# Altium schematic sheet Power.SchDoc
size A4
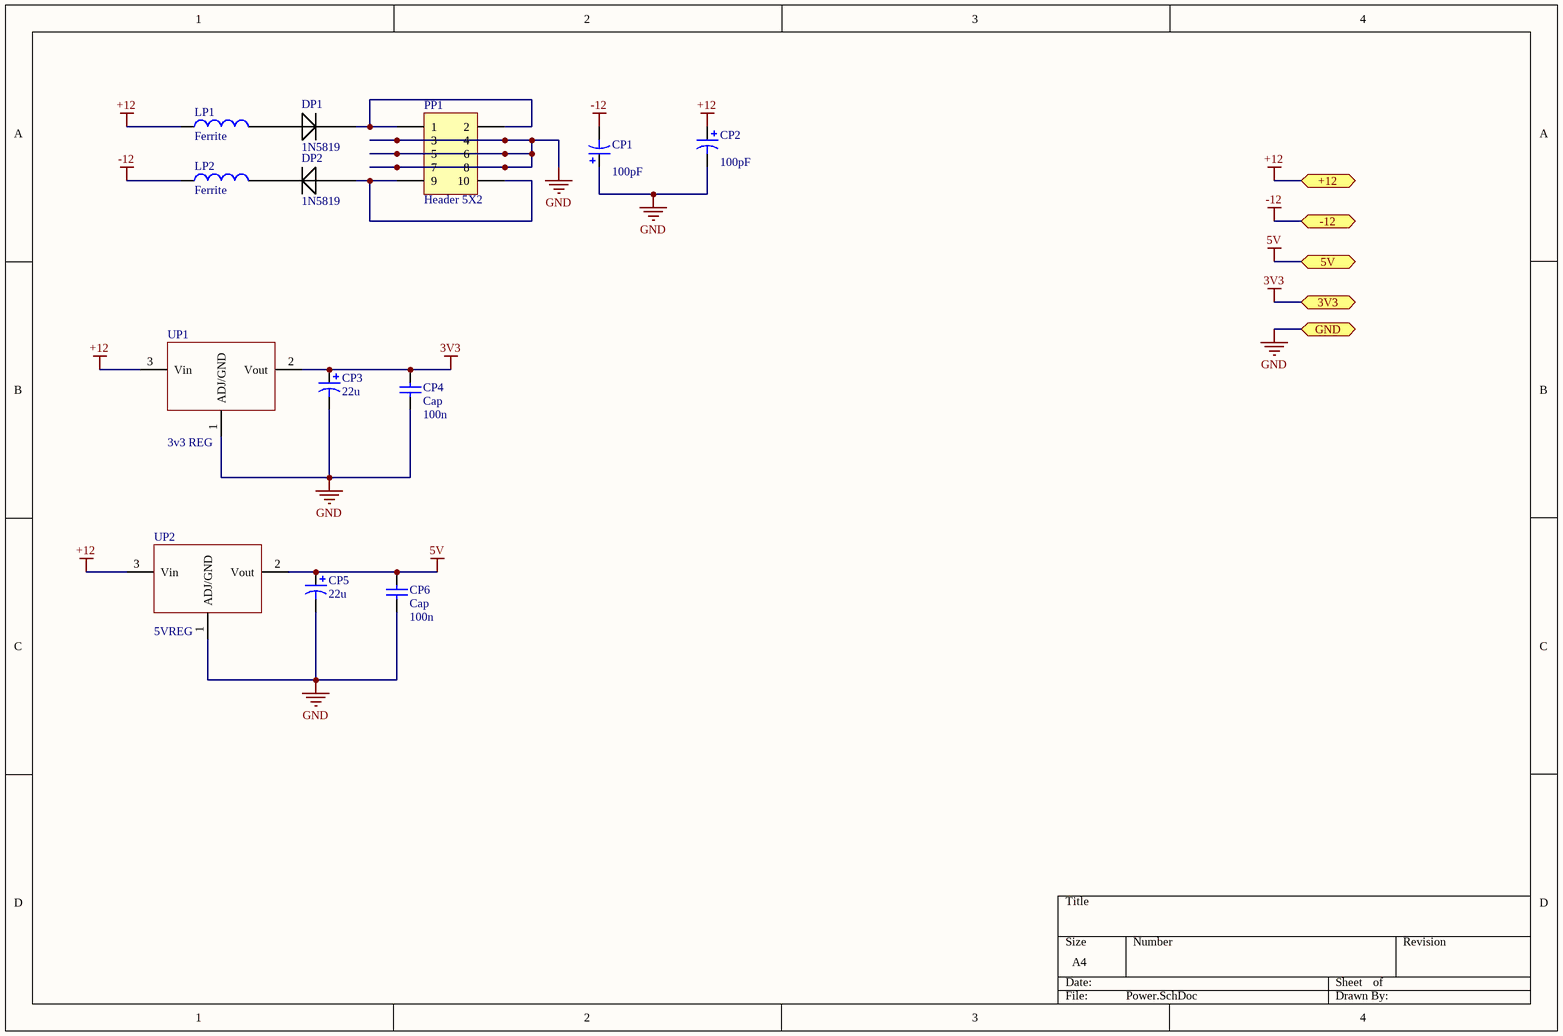
[diagram p0: Power.SchDoc]

## Parts
CP1  value 100pF  [C-RAD-4.5]  (hidden comment: Cap Pol2)
CP2  value 100pF  [C-RAD-4.5]  (hidden comment: Cap Pol2)
CP3  value 22u  [C 0603 / 1608]  (hidden comment: Cap Pol2)
CP4  Cap  value 100n  [C 0603 / 1608]
CP5  value 22u  [C 0603 / 1608]  (hidden comment: Cap Pol2)
CP6  Cap  value 100n  [C 0603 / 1608]
DP1  1N5819  [DO-41]
DP2  1N5819  [DO-41]
LP1  Ferrite  [RES0805R]
LP2  Ferrite  [RES0805R]
PP1  Header 5X2  [HDR2X5]
UP1  3v3 REG  [SOT-223-3 - REG]
UP2  5VREG  [SOT-223-3 - REG]

## Ports
3V3 (bidir), 5V (bidir), +12 (bidir), -12 (bidir), GND (bidir)

## Nets
3V3: CP3.1 CP4.2 UP1.2(Vout) ; port 3V3
5V: CP5.1 CP6.2 UP2.2(Vout) ; port 5V
+12: CP2.1 LP1.1 UP1.3(Vin) UP2.3(Vin) ; port +12
-12: CP1.2 LP2.1 ; port -12
GND: CP1.1 CP2.2 CP3.2 CP4.1 CP5.2 CP6.1 PP1.3 PP1.4 PP1.5 PP1.6 PP1.7 PP1.8 UP1.1(ADJ/GND) UP2.1(ADJ/GND) ; port GND
NetDP1_1: DP1.1 PP1.1 PP1.2
NetDP1_2: DP1.2 LP1.2
NetDP2_1: DP2.1 LP2.2
NetDP2_2: DP2.2 PP1.9 PP1.10

## Library data of the parts
CP1-CP3 CP5 = Cap Pol2: Polarized Capacitor (Axial); Published: 8-Jun-2000; LatestRevisionDate: 17-Jul-2002; LatestRevisionNote: Re-released for DXP Platform.; PackageReference: POLAR0.8; Publisher: Altium Limited; PackageDescription: Polarized Capacitor; 2 Leads
CP4 CP6 = Cap: Capacitor; Published: 8-Jun-2000; LatestRevisionDate: 17-Jul-2002; LatestRevisionNote: Re-released for DXP Platform.; PackageReference: RAD-0.3; Publisher: Altium Limited; PackageDescription: Radial Cap, Thru-Hole; 2 Leads; 0.3 in Pin Spacing
DP1 DP2 = Diode
LP1 LP2 = Inductor: Code_IEC: 1005; Value: 10mH; Published: 8-Jun-2000; LatestRevisionDate: 29-May-2009; LatestRevisionNote: IPC-7351 Footprint Added.; PackageReference: 0402-A; Publisher: Altium Limited; PackageDescription: Chip Inductor; Code_JEITA: 0402
PP1 = Header 5X2: Header, 5-Pin, Dual row; LatestRevisionDate: 17-Jul-2002; LatestRevisionNote: Re-released for DXP Platform.; Publisher: Altium Limited
UP1 UP2 = AMS1117: LDO 3.3V/5V/12V